# Altium schematic sheet PCB uC Slave Switch.SchDoc: PCB Slave uC Slave Switch Home Automation Wired
size A4; ApprovedBy: Imron Pramana; CheckedBy: Jimmy Andrianto; CompanyName: PT Elektrindodaya Pakarnusa; DrawnBy: Rangga Masli Putra; Address1: Jl. Soekarno Hatta km 13,8; Address2: Lingkungan Industri Kecil unit C8; Address3: Bandung; Address4: Indonesia; Revision: 1.0
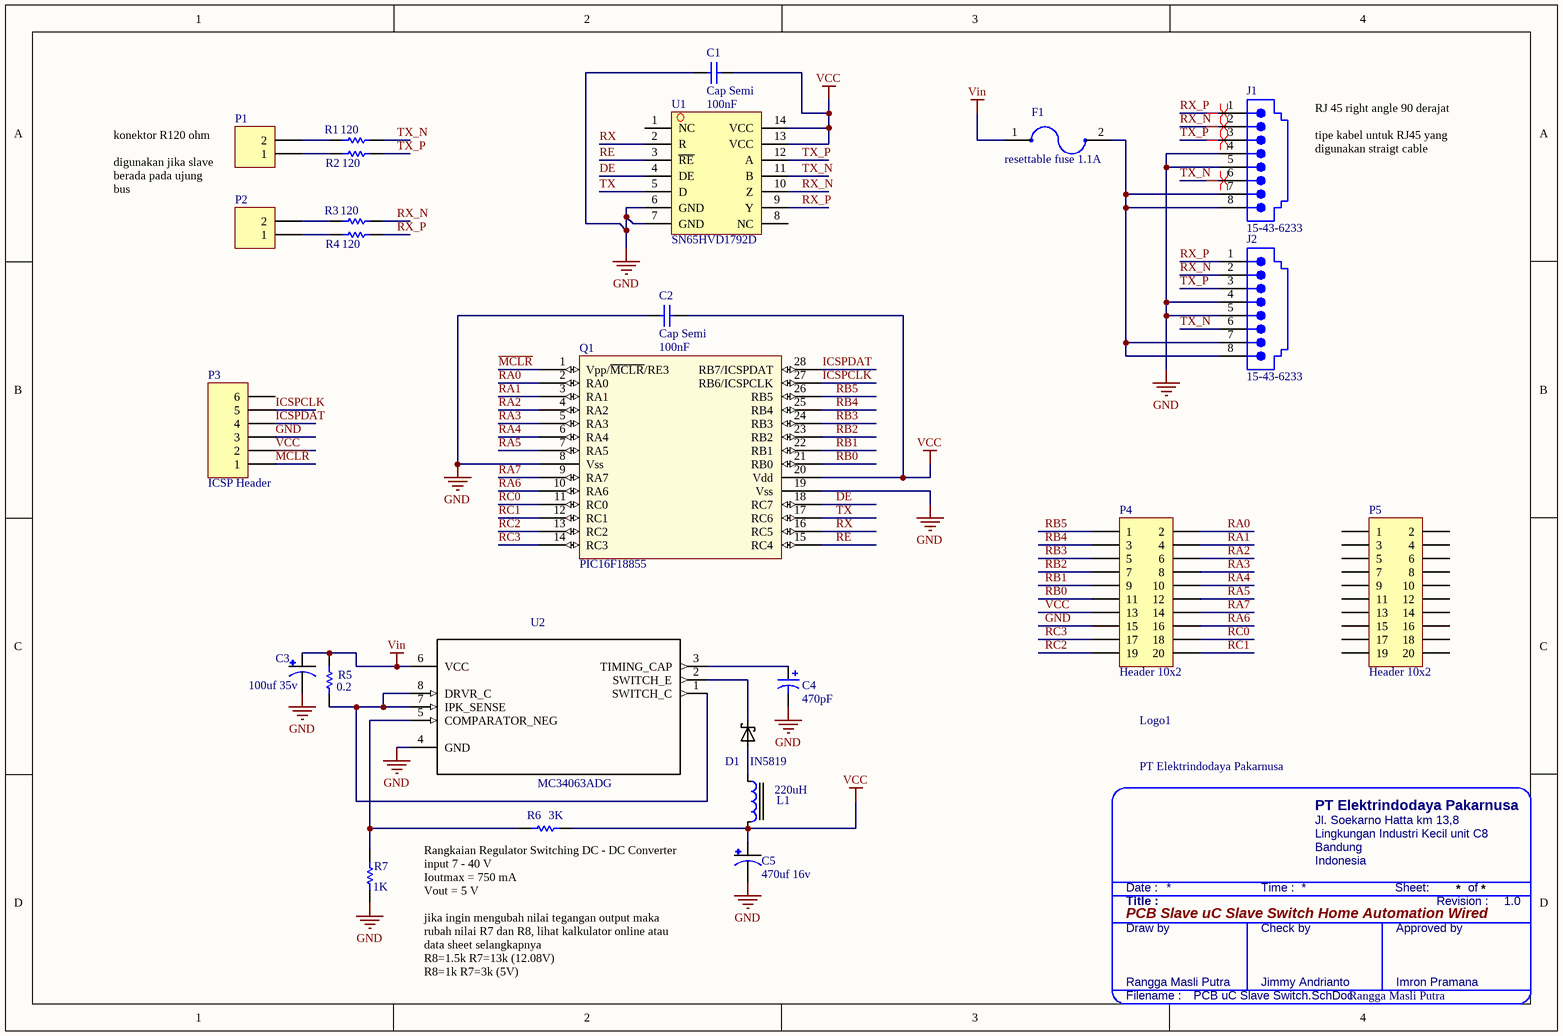
[diagram p0: PCB uC Slave Switch.SchDoc]

## Parts
C1  Cap Semi  value 100nF  [CAPC2012M]
C2  Cap Semi  value 100nF  [CAPC2012M]
C3  value 100uf 35v  [OSCON_SVPF_6.3MM]  (hidden comment: EDK107M050A9MAA)
C4  value 470pF  [CAPC2012M]  (hidden comment: Cap Pol3)
C5  value 470uf 16v  [CAPAE1030X1200_EEE-FC1C471AP(Primary)]  (hidden comment: EDK107M050A9MAA)
D1  IN5819  [DO-214AC_SS14(Primary)]
F1  resettable fuse 1.1A  [0805]
J1  15-43-6233  [15-43-6233]
J2  15-43-6233  [15-43-6233]
L1  220uH  [CDRH104R]
Logo1  PT Elektrindodaya Pakarnusa  [ElsaLogoTop]  (graphical)
P1  Header 2  [HDR1X2]  (value not drawn)
P2  Header 2  [HDR1X2]  (value not drawn)
P3  ICSP Header  [HDR1X6]
P4  Header 10x2  [HDR2X10 pitch 2mm hole]
P5  Header 10x2  [HDR2X10 pitch 2mm hole]
Q1  PIC16F18855  [SOP65P780X200-28N]
R1  value 120  [RESC1608M]  (hidden comment: Res1)
R2  value 120  [RESC1608M]  (hidden comment: Res1)
R3  value 120  [RESC1608M]  (hidden comment: Res1)
R4  value 120  [RESC1608M]  (hidden comment: Res1)
R5  value 0.2  [6-0805_N]  (hidden comment: Res1)
R6  value 3K  [RESC1608M]  (hidden comment: Res1)
R7  value 1K  [RESC1608M]  (hidden comment: Res1)
U1  SN65HVD1792D  [R-PDSO-G14]
U2  MC34063ADG  [SOIC127P600X175-8N]

## Nets
GND: C1.1 C2.1 C3.NEG C4.2 C5.NEG J1.4 J1.5 J2.4 J2.5 P3.3 P4.15 Q1.8(Vss) Q1.19(Vss) R7.1 U1.6(GND) U1.7(GND) U2.4(GND)
VCC: C1.2 C2.2 C5.POS L1.2 P3.2 P4.13 Q1.20(Vdd) R6.2 U1.13(VCC) U1.14(VCC)
Vin: C3.POS F1.1 R5.2 U2.6(VCC)
DE: Q1.18(RC7) U1.4(DE)
ICSPCLK: P3.5 Q1.27(RB6/ICSPCLK)
ICSPDAT: P3.4 Q1.28(RB7/ICSPDAT)
~{MCLR}: P3.1 Q1.1(Vpp/~{MCLR}/RE3)
RA0: P4.2 Q1.2(RA0)
RA1: P4.4 Q1.3(RA1)
RA2: P4.6 Q1.4(RA2)
RA3: P4.8 Q1.5(RA3)
RA4: P4.10 Q1.6(RA4)
RA5: P4.12 Q1.7(RA5)
RA6: P4.16 Q1.10(RA6)
RA7: P4.14 Q1.9(RA7)
RB0: P4.11 Q1.21(RB0)
RB1: P4.9 Q1.22(RB1)
RB2: P4.7 Q1.23(RB2)
RB3: P4.5 Q1.24(RB3)
RB4: P4.3 Q1.25(RB4)
RB5: P4.1 Q1.26(RB5)
RC0: P4.18 Q1.11(RC0)
RC1: P4.20 Q1.12(RC1)
RC2: P4.19 Q1.13(RC2)
RC3: P4.17 Q1.14(RC3)
RE: Q1.15(RC4) U1.3(~{RE})
RX: Q1.16(RC5) U1.2(R)
RX_N: J1.2 J2.2 R3.2 U1.10(Z)
RX_P: J1.1 J2.1 R4.2 U1.9(Y)
TX: Q1.17(RC6) U1.5(D)
TX_N: J1.6 J2.6 R1.2 U1.11(B)
TX_P: J1.3 J2.3 R2.2 U1.12(A)
NetC4_1: C4.1 U2.3(TIMING_CAP)
NetD1_A: D1.A L1.1
NetD1_C: D1.C U2.2(SWITCH_E)
NetF1_2: F1.2 J1.7 J1.8 J2.7 J2.8
NetP1_1: P1.1 R2.1
NetP1_2: P1.2 R1.1
NetP2_1: P2.1 R4.1
NetP2_2: P2.2 R3.1
NetR5_1: R5.1 U2.1(SWITCH_C) U2.7(IPK_SENSE) U2.8(DRVR_C)
NetR6_1: R6.1 R7.2 U2.5(COMPARATOR_NEG)

Not connected (* = marked no-connect by the designer): P3 6; P5 1 2 3 4 5 6 7 8 9 10 11 12 13 14 15 16 17 18 19 20; U1 1(NC) 8(NC)

## Layout directives
differential pair: RX_N, RX_P, TX_N, TX_P

## Notes on the sheet
- RJ 45 right angle 90 derajat
  tipe kabel untuk RJ45 yang digunakan straigt cable
- konektor R120 ohm
  digunakan jika slave berada pada ujung bus
- (near R6) Rangkaian Regulator Switching DC - DC Converter
  input 7 - 40 V
  Ioutmax = 750 mA
  Vout = 5 V
  jika ingin mengubah nilai tegangan output maka rubah nilai R7 dan R8, lihat kalkulator online atau data sheet selangkapnya
  R8=1.5k R7=13k (12.08V)
  R8=1k R7=3k (5V)
- Date :
- Title :
- Time :
- Sheet:           of
- Revision :
- Draw by
- Check by
- Approved by
- Filename :

## Library data of the parts
C1 C2 = Cap Semi: Capacitor (Semiconductor SIM Model); Published: 8-Jun-2000; LatestRevisionDate: 29-May-2009; LatestRevisionNote: IPC-7351 Footprint Added.; PackageReference: C1206; Publisher: Altium Limited; PackageDescription: Chip Capacitor
C3 C5 = EDK107M050A9MAA: Cap, Alu Elec, 100uf, 50v, Smd; MF: Kemet; Package: Radial Kemet; MP: EDK107M050A9MAA; Price: 0.28 USD; Availability: Good
C4 = Cap Pol3: Polarized Capacitor (Surface Mount); Published: 8-Jun-2000; LatestRevisionDate: 29-May-2009; LatestRevisionNote: IPC-7351 Footprint Added.; PackageReference: C0805; Publisher: Altium Limited; PackageDescription: Chip Capacitor
D1 = SS14: 1a 40v Smd Schottky Rectifier; MF: Taiwan Semiconductor; Price: 0.12 USD; Package: DO-214 Taiwan Semiconductor; MP: SS14; Availability: Good; Value: *
F1 = resettable fuse 1.1A 0805: MF: Littelfuse; Availability: Good; Value: *
J1 J2 = 15-43-6233: Right Angle, Standard Profile, RJ45-Keyed, Flange Mount PCB Jack; Ports: 1; Positions/Loaded: Port1 - 8 Keyed/8; PerformanceCategory: 3; PCB_Mounting: Thru-Hole; ComponentAvailability: Obsolete; DrillSize: Nominal, Rounded to nearest 0.05mm; PCB_Layout: Complies with Manufacturer's Recommendation.; Published: 25-Jun-2002; DatasheetDocument: 18-Dec-2001; PackageDocument: 18-Dec-2001; PackageReference: 15-43-6233; Publisher: Altium Limited; ComponentLink1Description: Manufacturer Link; ComponentLink1URL: http://www.molex.com/; ComponentLink2Description: Datasheet; ComponentLink2URL: http://www.molex.com/cmc_upload/common_files/1212003_catalogmx41314.pdf; ComponentLink3Description: Iges Model; ComponentLink3URL: http://www.molex.com/pdm_docs/igs/15-43-6233_igs.zip
L1 = CDRH104R: Inductor Power Shielded Drum Core 220uH; MF: Sumida; MP: CDRH104RNP-101NC; Price: 0.99 USD; Package: Nonstandard Sumida; Availability: Good; Value: *
Logo1 = ElsaLogoTopOverlay: Elsa Company Logo; Create by: Jimmy Andrianto
P1 P2 = Header 2: Header, 2-Pin; LatestRevisionDate: 17-Jul-2002; LatestRevisionNote: Re-released for DXP Platform.; Publisher: Altium Limited
P3 = Header 6: Header, 6-Pin; LatestRevisionDate: 17-Jul-2002; LatestRevisionNote: Re-released for DXP Platform.; Publisher: Altium Limited
P4 P5 = Header 10x2: Header, 14-Pin, Dual row; LatestRevisionDate: 17-Jul-2002; LatestRevisionNote: Re-released for DXP Platform.; Publisher: Altium Limited
Q1 = PIC16F18855: PIC16F18855-SSOP 28 pin; ComponentLinkURL: http://ww1.microchip.com/downloads/en/DeviceDoc/400001802D.pdf
R1-R7 = Res1: Resistor; Published: 8-Jun-2000; LatestRevisionDate: 17-Jul-2002; LatestRevisionNote: Re-released for DXP Platform.; PackageReference: AXIAL-0.3; Publisher: Altium Limited; PackageDescription: Axial Device, Thru-Hole; 2 Leads; 0.3 in Pin Spacing
U2 = MC34063ADG: MC34063A Series 40V 1.5A 100kHz Step-Up/Down/Inverting Switching Regulator-SOIC8; MF: ON Semiconductor; Price: 0.36 USD; MP: MC34063ADG; Availability: Good; Package: SOIC-8 ON Semiconductor; Value: *